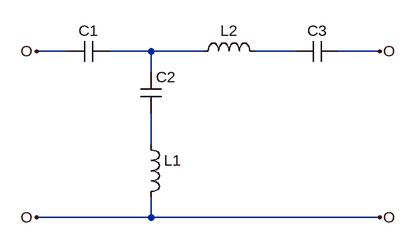
[diagram p0: schematic Draft1.asc]
Draft1.asc, the LTspice schematic file:
Version 4
SHEET 1 880 680
WIRE 32 128 -16 128
WIRE 160 128 96 128
WIRE 240 128 160 128
WIRE 384 128 320 128
WIRE 512 128 448 128
WIRE 160 160 160 128
WIRE 160 272 160 224
WIRE 160 384 160 352
WIRE 160 384 -16 384
WIRE 512 384 160 384
FLAG -16 128 O
FLAG -16 384 O
FLAG 512 384 O
FLAG 512 128 O
SYMBOL cap 96 112 R90
WINDOW 0 0 32 VBottom 2
WINDOW 3 32 32 VTop 2
SYMATTR InstName C1
SYMATTR Value ""
SYMBOL cap 144 160 R0
SYMATTR InstName C2
SYMATTR Value ""
SYMBOL ind 144 256 R0
SYMATTR InstName L1
SYMATTR Value ""
SYMBOL cap 448 112 R90
WINDOW 0 0 32 VBottom 2
WINDOW 3 32 32 VTop 2
SYMATTR InstName C3
SYMATTR Value ""
SYMBOL ind 224 144 R270
WINDOW 0 32 56 VTop 2
WINDOW 3 5 56 VBottom 2
SYMATTR InstName L2
SYMATTR Value ""

The netlist it stands for:
* Draft1.asc
C1 N001 O
C2 N001 N003
L1 N003 O
C3 O N002
L2 N001 N002
.backanno
.end